# Altium schematic sheet Sheet.test.Power.SchDoc
size A4
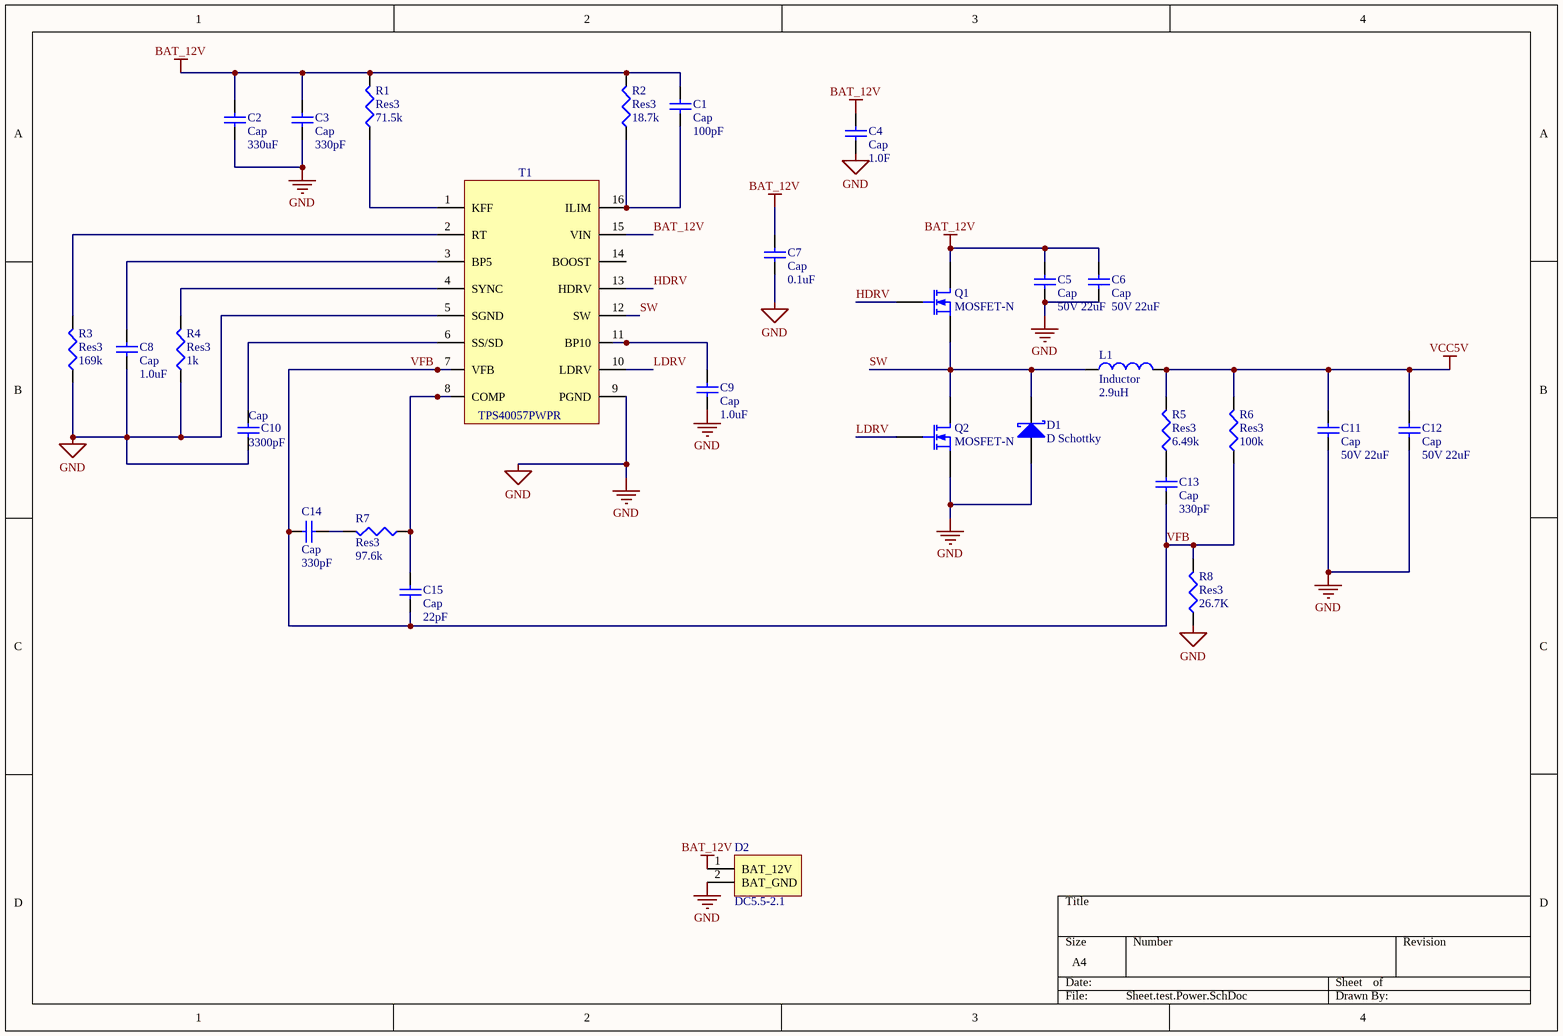
[diagram p0: Sheet.test.Power.SchDoc]

## Parts
C1  Cap  value 100pF  [RAD-0.3]
C2  Cap  value 330uF  [RAD-0.3]
C3  Cap  value 330pF  [RAD-0.3]
C4  Cap  value 1.0F  [RAD-0.3]
C5  Cap  value 50V 22uF  [RAD-0.3]
C6  Cap  value 50V 22uF  [RAD-0.3]
C7  Cap  value 0.1uF  [RAD-0.3]
C8  Cap  value 1.0uF  [RAD-0.3]
C9  Cap  value 1.0uF  [RAD-0.3]
C10  Cap  value 3300pF  [RAD-0.3]
C11  Cap  value 50V 22uF  [RAD-0.3]
C12  Cap  value 50V 22uF  [RAD-0.3]
C13  Cap  value 330pF  [RAD-0.3]
C14  Cap  value 330pF  [RAD-0.3]
C15  Cap  value 22pF  [RAD-0.3]
D1  D Schottky  [SMB]
D2  DC5.5-2.1
L1  Inductor  value 2.9uH  [0402-A]
Q1  MOSFET-N  [E3]
Q2  MOSFET-N  [E3]
R1  Res3  value 71.5k  [J1-0603]
R2  Res3  value 18.7k  [J1-0603]
R3  Res3  value 169k  [J1-0603]
R4  Res3  value 1k  [J1-0603]
R5  Res3  value 6.49k  [J1-0603]
R6  Res3  value 100k  [J1-0603]
R7  Res3  value 97.6k  [J1-0603]
R8  Res3  value 26.7K  [J1-0603]
T1  TPS40057PWPR

## Nets
BAT_12V: C1.2 C2.2 C3.2 C4.2 C5.2 C6.2 C7.2 D2.1(BAT_12V) Q1.1(D) R1.2 R2.2 T1.15(VIN)
GND: C2.1 C3.1 C4.1 C5.1 C6.1 C7.1 C8.1 C9.1 C10.1 C11.1 C12.1 D1.1(A) D2.2(BAT_GND) Q2.3(S) R3.1 R4.1 R8.1 T1.5(SGND) T1.9(PGND)
VCC5V: C11.2 C12.2 L1.2 R5.2 R6.2
HDRV: Q1.2(G) T1.13(HDRV)
LDRV: Q2.2(G) T1.10(LDRV)
SW: D1.2(K) L1.1 Q1.3(S) Q2.1(D) T1.12(SW)
VFB: C13.1 C14.2 C15.1 R6.1 R8.2 T1.7(VFB)
NetC1_1: C1.1 R2.1 T1.16(ILIM)
NetC8_2: C8.2 T1.3(BP5)
NetC9_2: C9.2 T1.11(BP10)
NetC10_2: C10.2 T1.6(SS/SD)
NetC13_2: C13.2 R5.1
NetC14_1: C14.1 R7.2
NetC15_2: C15.2 R7.1 T1.8(COMP)
NetR1_1: R1.1 T1.1(KFF)
NetR3_2: R3.2 T1.2(RT)
NetR4_2: R4.2 T1.4(SYNC)

Not connected (* = marked no-connect by the designer): T1 14(BOOST)

## Library data of the parts
C1-C15 = Cap: Capacitor; Published: 8-Jun-2000; LatestRevisionDate: 17-Jul-2002; LatestRevisionNote: Re-released for DXP Platform.; PackageReference: RAD-0.3; Publisher: Altium Limited; PackageDescription: Radial Cap, Thru-Hole; 2 Leads; 0.3 in Pin Spacing
D1 = D Schottky: Schottky Diode; Published: 8-Jun-2000; LatestRevisionDate: 17-Jul-2002; LatestRevisionNote: Re-released for DXP Platform.; PackageReference: SMB; Publisher: Altium Limited; PackageDescription: DO-214-AA/SMB; 2 C-Bend Leads; Body 5.3 x 3.6 mm, inc. leads (LxW); Code_JEDEC: DO-214-AA
L1 = Inductor: Code_IEC: 1005; Published: 8-Jun-2000; LatestRevisionDate: 29-May-2009; LatestRevisionNote: IPC-7351 Footprint Added.; PackageReference: 0402-A; Publisher: Altium Limited; PackageDescription: Chip Inductor; Code_JEITA: 0402
Q1 Q2 = MOSFET-N: N-Channel MOSFET; Published: 8-Jun-2000; LatestRevisionDate: 17-Jul-2002; LatestRevisionNote: Re-released for DXP Platform.; PackageVersion: 1995/1996; PackageReference: E3; Publisher: Altium Limited; PackageDescription: TO, Flat Index; 3 In-Line, Axial Leads; Body Dia. 4.6mm; Lead Dia. 0.5 mm (max)
R1-R8 = Res3: Resistor; Published: 8-Jun-2000; LatestRevisionDate: 29-May-2009; LatestRevisionNote: IPC-7351 Footprint Added.; PackageReference: J1-0603; Publisher: Altium Limited; PackageDescription: Chip Resistor
T1 = TPS4005x